# Altium schematic sheet Downstream_Controller.SchDoc: Downstream Controller
size 431 x 279 mm; Author: Eric Liu; SheetNumber: 2; SheetTotal: 6
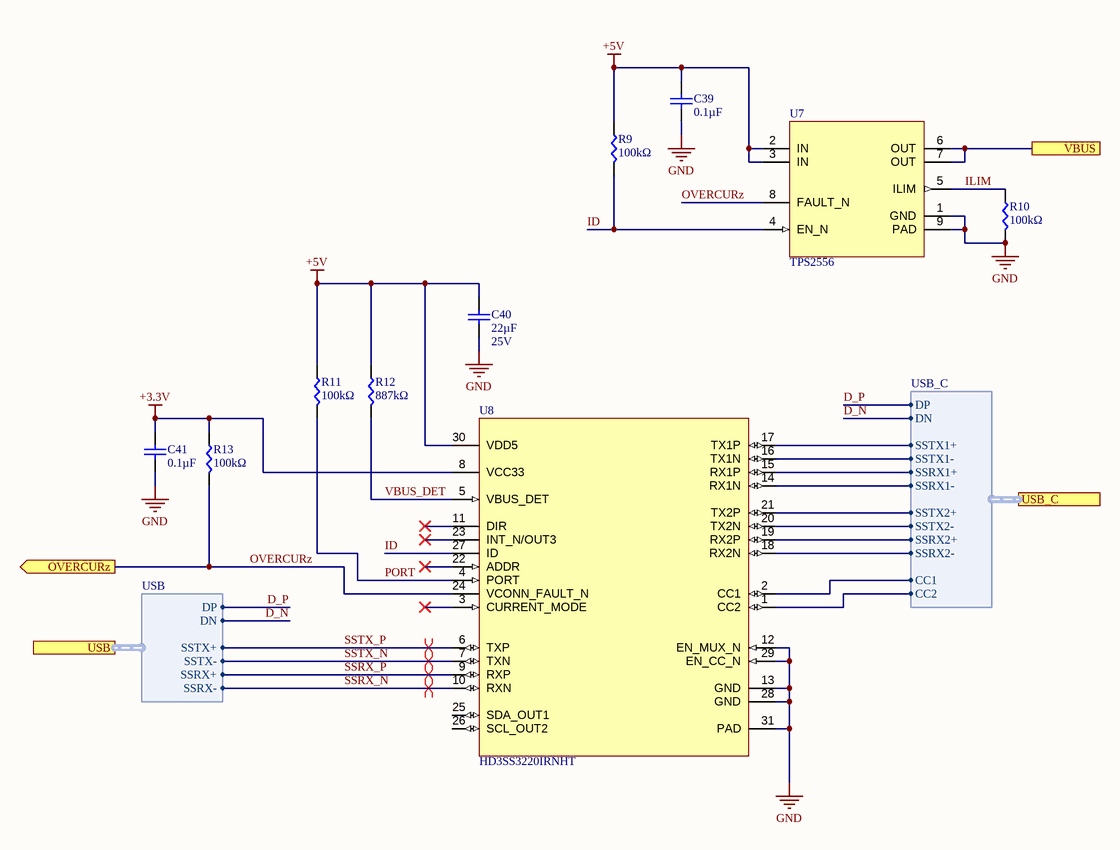
[diagram p0: Downstream_Controller.SchDoc]

## Parts
C39  value 0.1µF  [CAP0402]  (hidden comment: CC0402KRX5R9BB104)
C40  value 22µF  Voltage: 25V  [CAP0805]  (hidden comment: CL21A226MAYNNNE)
C41  value 0.1µF  [CAP0402]  (hidden comment: CC0402KRX5R9BB104)
R9  value 100kΩ  [RES0402]  (hidden comment: ERJ-2RKF1003X)
R10  value 100kΩ  [RES0402]  (hidden comment: ERJ-2RKF1003X)
R11  value 100kΩ  [RES0402]  (hidden comment: ERJ-2RKF1003X)
R12  value 887kΩ  [RES0402]  (hidden comment: RMCF0402FT887K)
R13  value 100kΩ  [RES0402]  (hidden comment: ERJ-2RKF1003X)
U7  TPS2556  [8-SON (3x3)]
U8  HD3SS3220IRNHT  [30-WFQFN Exposed Pad]

## Ports
OVERCURz (out), USB (harness USB), USB_C (harness USB_C), VBUS

## Harnesses
USB: DP, DN, SSRX+, SSRX-, SSTX+, SSTX-
USB_C: DP, DN, SSRX1+, SSRX1-, SSTX1+, SSTX1-, SSRX2+, SSRX2-, SSTX2+, SSTX2-, CC1, CC2

## Nets
+3.3V: C41.2 R13.2 U8.8(VCC33)
+5V: C39.2 C40.2 R9.2 R11.2 R12.2 U7.2(IN) U7.3(IN) U8.30(VDD5)
GND: C39.1 C40.1 C41.1 R10.1 U7.1(GND) U7.9(PAD) U8.12(EN_MUX_N) U8.13(GND) U8.28(GND) U8.29(EN_CC_N) U8.31(PAD)
D_N: port USB.DN, port USB_C.DN
D_P: port USB.DP, port USB_C.DP
ID: R9.1 U7.4(EN_N) U8.27(ID)
ILIM: R10.2 U7.5(ILIM)
OVERCURz: R13.1 U7.8(FAULT_N) U8.24(VCONN_FAULT_N) ; port OVERCURz
PORT: R11.1 U8.4(PORT)
SSRX_N: U8.10(RXN) ; port USB.SSRX-
SSRX_P: U8.9(RXP) ; port USB.SSRX+
SSTX_N: U8.7(TXN) ; port USB.SSTX-
SSTX_P: U8.6(TXP) ; port USB.SSTX+
VBUS: U7.6(OUT) U7.7(OUT) ; port VBUS
VBUS_DET: R12.1 U8.5(VBUS_DET)
NetU8_1: U8.1(CC2) ; port USB_C.CC2
NetU8_2: U8.2(CC1) ; port USB_C.CC1
NetU8_14: U8.14(RX1N) ; port USB_C.SSRX1-
NetU8_15: U8.15(RX1P) ; port USB_C.SSRX1+
NetU8_16: U8.16(TX1N) ; port USB_C.SSTX1-
NetU8_17: U8.17(TX1P) ; port USB_C.SSTX1+
NetU8_18: U8.18(RX2N) ; port USB_C.SSRX2-
NetU8_19: U8.19(RX2P) ; port USB_C.SSRX2+
NetU8_20: U8.20(TX2N) ; port USB_C.SSTX2-
NetU8_21: U8.21(TX2P) ; port USB_C.SSTX2+

Not connected (* = marked no-connect by the designer): U8 3(CURRENT_MODE)* 11(DIR)* 22(ADDR)* 23(INT_N/OUT3)* 25(SDA_OUT1) 26(SCL_OUT2)

## Layout directives
differential pair: SSRX_N, SSRX_P, SSTX_N, SSTX_P

## Notes on the sheet
- DWG. NO.
- REV.
- SHT.
- THIS DOCUMENT AND THE DATA DISCLOSED HEREIN OR HEREWITH IS THE PROPERTY OF ALTIUM LIMITED AND MAY BE FREELY DISTRIBUTED IN WHOLE. NO RIGHTS ARE RESERVED OR EXPRESS OR IMPLIED WARANTEE GIVEN.
- REVISION
- DESCRIPTION
- DATE
- APPROVED
- ENG:
- APPROVALS
- PROJECT
- DSN:
- CHK:
- REFERENCE DOCUMENTS
- PROJECT REVISION:
- TITLE
- DOCUMENT REVISION:
- DESIGN ITEM:
- BOM:
- FAB DWG:
- PCB DWG:
- ASSY DWG:
- SCALE:
- SIZE
- B
- CAGE CODE
- FILE NAME
- DWG NO.
- SHEET
- OF
- REV

## Library data of the parts
C39 C41 = CC0402KRX5R9BB104: 0.1 µF ±10% 50V Ceramic Capacitor X5R 0402 (1005 Metric); Temperature Coefficient: X5R; Package: 0402 (1005 Metric); Voltage: 50V
C40 = CL21A226MAYNNNE: 22 µF ±20% 25V Ceramic Capacitor X5R 0805 (2012 Metric); Temperature Coefficient: X5R; Package: 0805 (2012 Metric)
R9-R11 R13 = ERJ-2RKF1003X: 100 kOhms ±1% 0.1W, 1/10W Chip Resistor 0402 (1005 Metric) Automotive AEC-Q200 Thick Film; Manufacturer 1: Panasonic Electronic Components; Manufacturer Part Number 1: ERJ-2RKF1003X; Supplier Part Number 1: P100KLCT-ND; Supplier 1: Digi-Key; Power Rating: 1/10W
R12 = RMCF0402FT887K: 887 kOhms ±1% 0.063W, 1/16W Chip Resistor 0402 (1005 Metric) Automotive AEC-Q200 Thick Film; Manufacturer 1: Stackpole Electronics Inc; Manufacturer Part Number 1: RMCF0402FT887K; Supplier Part Number 1: RMCF0402FT887KCT-ND; Supplier 1: Digi-Key; Power Rating: 1/16W
U7 = TPS2556: Power Switch/Driver 1:1 N-Channel 5A 8-SON (3x3); Manufacturer: Texas Instruments; Manufacturer Product Number: TPS2556DRBR; Supplier: DigiKey; Supplier Part Number: 296-39382-1-ND; Datasheet: https://www.ti.com/lit/ds/symlink/tps2557.pdf?ts=1772363913218; Operating Temperature: -40°C ~ 125°C
U8 = HD3SS3220IRNHT: USB, Type-C Controller PMIC 30-WQFN (4.5x2.5); Manufacturer: Texas Instruments; Manufacturer Product Number: HD3SS3220IRNHT; Supplier: DigiKey; Supplier Part Number: 296-43694-1-ND; Datasheet: https://www.ti.com/lit/ds/symlink/hd3ss3220.pdf?HQS=dis-dk-null-digikeymode-dsf-pf-null-wwe&ts=1772376564629&ref_url=https%253A%252F%252Fwww.ti.com%252Fgeneral%252Fdocs%252Fsuppproductinfo.tsp%253FdistId%253D10%2526gotoUrl%253Dhttps%253A%252F%252Fwww.ti.com%252Flit%252Fgpn%252Fhd3ss3220; Operating Temperature: -40°C ~ 85°C